# Altium schematic sheet Audio_AND_HPJ.SchDoc
size A4; SheetNumber: 4; SheetTotal: 20
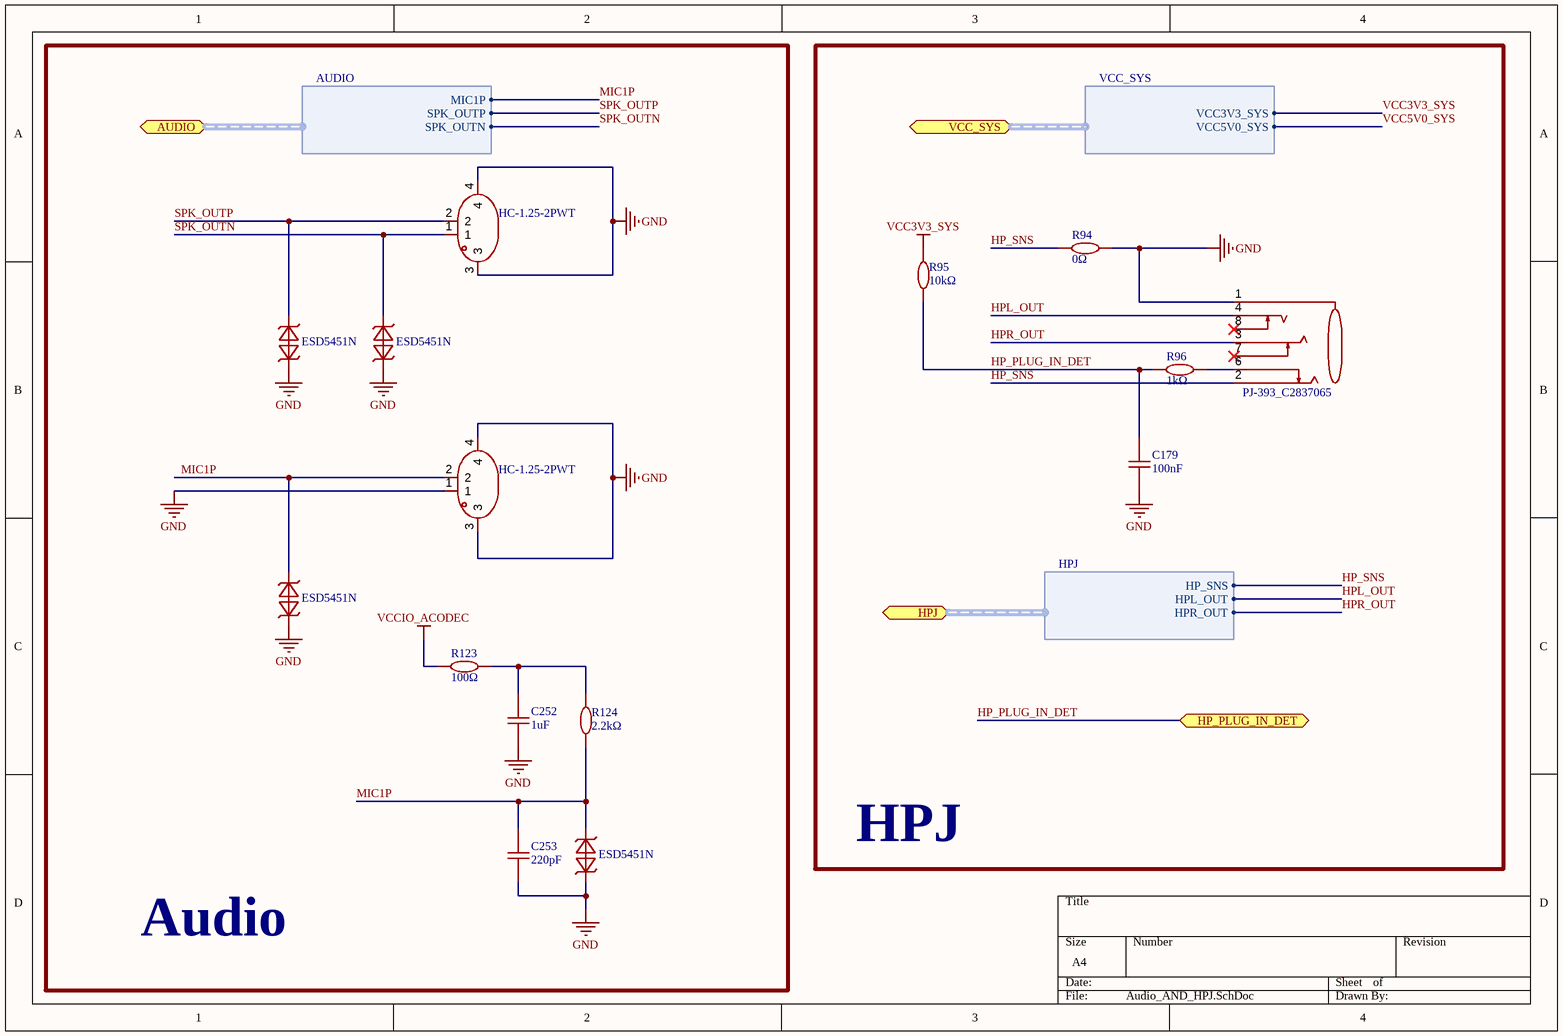
[diagram p0: Audio_AND_HPJ.SchDoc]

## Parts
AUDIO1  PJ-393_C2837065  [AUDIO-SMD_PJ-393]
C179  100nF  [C0402]
C252  1uF  [C0402]
C253  220pF  [C0402]
CN3  HC-1.25-2PWT  [CONN-SMD_2P-P1.25-HC-1.25-2PWT]
CN4  HC-1.25-2PWT  [CONN-SMD_2P-P1.25-HC-1.25-2PWT]
R94  0Ω  [R0402]
R95  10kΩ  [R0402]
R96  1kΩ  [R0402]
R123  100Ω  [R0402]
R124  2.2kΩ  [R0402]
U23  ESD5451N  [DFN1006-2L-BI]
U24  ESD5451N  [DFN1006-2L-BI]
U25  ESD5451N  [DFN1006-2L-BI]
U26  ESD5451N  [DFN1006-2L-BI]

## Blocks framed on the sheet
Audio: C252 C253 CN3 CN4 R123 R124 U23-U26
HPJ: AUDIO1 C179 R94-R96

## Ports
AUDIO (bidir, harness AUDIO, see Overview[2B], POWER[3D], POWER_PMIC[2D]), HP_PLUG_IN_DET (bidir, see Overview[2B], RK3566[3C], RK3566_OSC_PLL_PMUO1_2[7C]), HPJ (bidir, harness HPJ, see Overview[2B], POWER[3D], POWER_PMIC[6D]), VCC_SYS (bidir, harness VCC_SYS, see Overview[2B], DEBUG_AND_GPIO[1D], HDMI[2C], MIPI_DSI_TP[6A], POWER[3B], POWER[6B], POWER_EXTENSION[4D], POWER_FLASH_POWER_MANAGE[3C], POWER_PMIC[6D], Wi-Fi_BT[3D])

## Harnesses
AUDIO: SPK_OUTP, SPK_OUTN, MIC1P
HPJ: HPL_OUT, HPR_OUT, HP_SNS
VCC_SYS: VCC3V3_SYS, VCC5V0_SYS

## Nets
GND: AUDIO1.1 C179.1 C252.1 C253.1 CN3.3 CN3.4 CN4.1 CN4.3 CN4.4 R94.2 U23.1 U24.1 U25.1 U26.1
VCC3V3_SYS: R95.2 ; port VCC_SYS.VCC3V3_SYS
VCCIO_ACODEC: R123.1
HP_PLUG_IN_DET: C179.2 R95.1 R96.1 ; port HP_PLUG_IN_DET
HP_SNS: AUDIO1.2 R94.1 ; port HPJ.HP_SNS
HPL_OUT: AUDIO1.4 ; port HPJ.HPL_OUT
HPR_OUT: AUDIO1.3 ; port HPJ.HPR_OUT
MIC1P: C253.2 CN4.2 R124.1 U25.2 U26.2 ; port AUDIO.MIC1P
SPK_OUTN: CN3.1 U24.2 ; port AUDIO.SPK_OUTN
SPK_OUTP: CN3.2 U23.2 ; port AUDIO.SPK_OUTP
VCC5V0_SYS: port VCC_SYS.VCC5V0_SYS
NetAUDIO1_6: AUDIO1.6 R96.2
NetC252_2: C252.2 R123.2 R124.2

Not connected (* = marked no-connect by the designer): AUDIO1 7* 8*

## Library data of the parts
AUDIO1 = PJ-393_C2837065: 3.5mm耳机座 七脚四极带三组开关耳机插座；耐高温贴片耳机插座; Symbol: PJ-393_C2837065
C179 = 100nF: 50V 100nF X7R ±10% 0402 Ceramic Capacitors ROHS
C252 = 1uF: 50V 1uF X5R ±10% 0402 Ceramic Capacitors ROHS
C253 = 220pF: 16V 220pF X7R ±10% 0402 Ceramic Capacitors ROHS
CN3 CN4 = HC-1.25-2PWT: SMD,P=1.25mm,卧贴  1x2P 间距:1.25mm 卧贴 系列:PicoBlade(MX 1.25); Symbol: HC-1.25-2PWT
R94 = 0Ω: 0Ω 62.5mW 50V Thick Film Resistor ±1% 0402 Chip Resistor - Surface Mount ROHS
R95 = 10kΩ: 62.5mW 10kΩ 50V ±100ppm/℃ Thick Film Resistor ±1% 0402 Chip Resistor - Surface Mount ROHS
R96 = 1kΩ: 1kΩ 62.5mW 50V ±100ppm/℃ Thick Film Resistor ±1% 0402 Chip Resistor - Surface Mount ROHS
R123 = 100Ω: 100Ω 62.5mW 50V ±100ppm/℃ Thick Film Resistor ±1% 0402 Chip Resistor - Surface Mount ROHS
R124 = 2.2kΩ: 2.2kΩ ±1% 62.5mW 厚膜电阻
U23-U26 = ESD5451N: 是双向 TVS（瞬态电压抑制器），专门用于保护连接到低速数据线和控制线的敏感电子元件，使其免受 ESD（静电放电）、EFT（电快速瞬变）和浪涌引起的过应力影响。; Symbol: ESD5451N